# Altium schematic sheet Sheet1.SchDoc (part 1 of 3)
size 431 x 279 mm; SheetNumber: 1; SheetTotal: 1
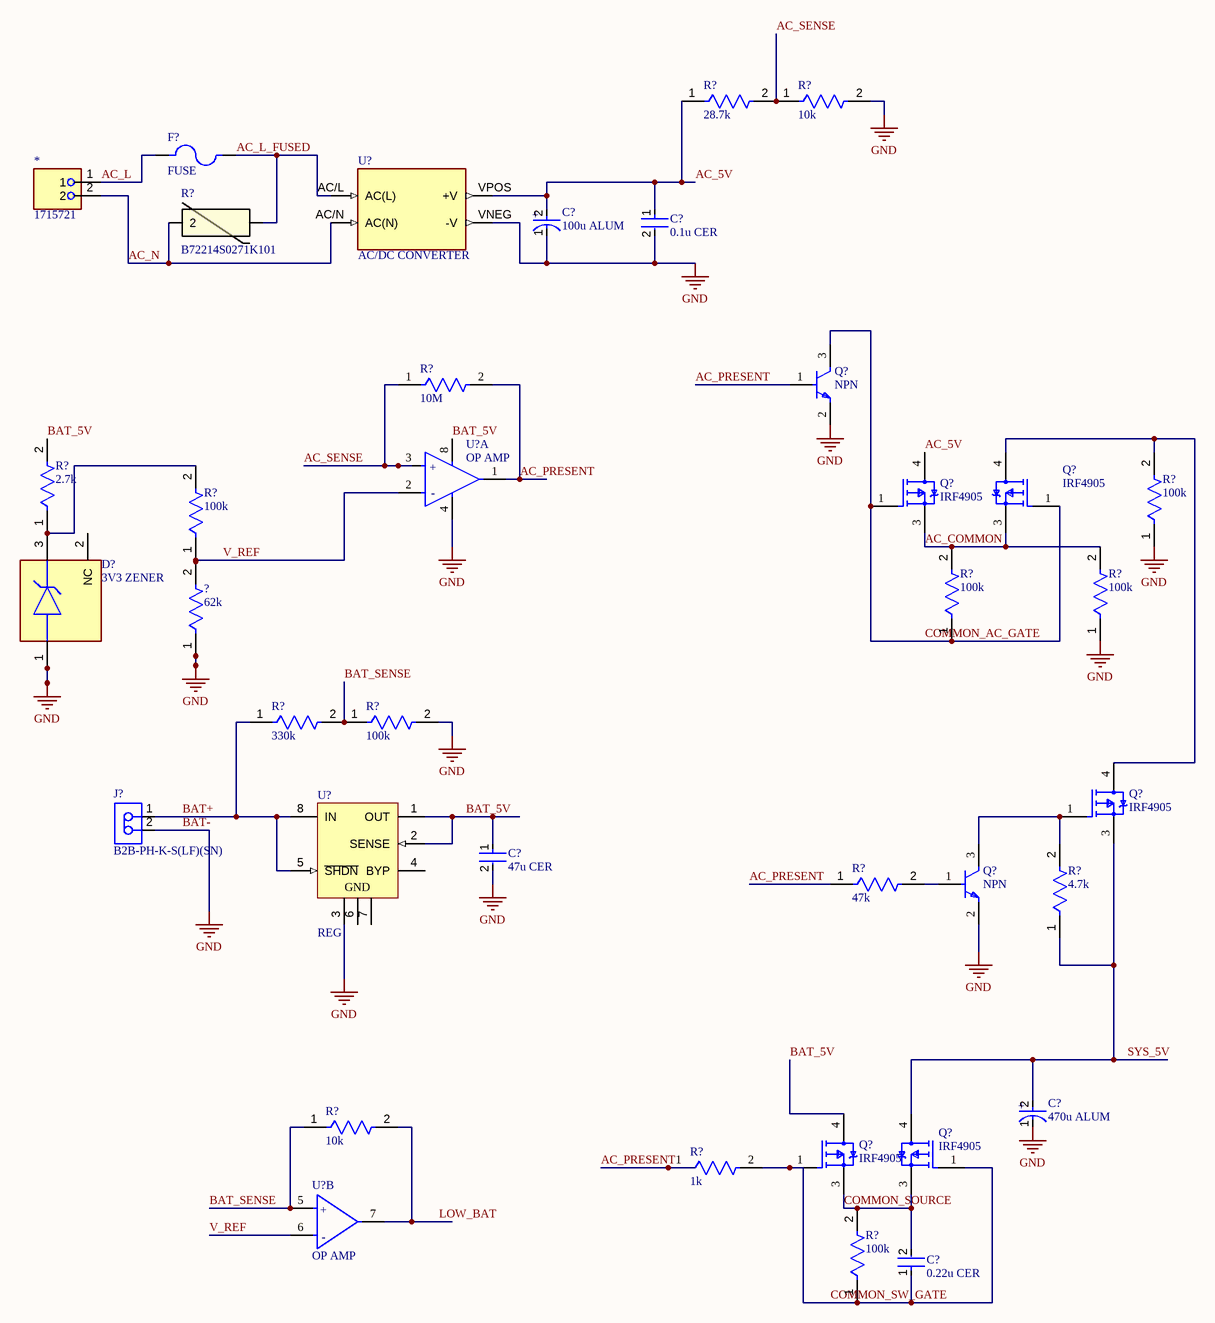
[diagram p0: Sheet1.SchDoc]

## Parts
(Parts that share a designator on the sheet are numbered #1, #2 ... from top to bottom, then left to right.)
*  1715721  [CONN_1715721_PXC]
?  62k  [0805_RES]
C?#1  100u ALUM  [FP-FTC-MFG]
C?#2  0.1u CER  [0805_CER_CAP]
C?#3  47u CER  [0805_CER_CAP]
C?#4  470u ALUM  [Radial_SMD_CAP]
C?#5  0.22u CER  [0805_CER_CAP]
D?  3V3 ZENER  [FP-SOT23-IPC_B_ZENER]
F?  FUSE  [FUSE_4628]
J?  B2B-PH-K-S(LF)(SN)  [JST-B2B-PH-K-S_V]
Q?#1  NPN  [FP-SOT323-IPC_B]
Q?#2  IRF4905  [FP-PG-TO263-3-MFG]
Q?#3  IRF4905  [FP-PG-TO263-3-MFG]
Q?#4  IRF4905  [FP-PG-TO263-3-MFG]
Q?#5  NPN  [FP-SOT323-IPC_B]
Q?#6  IRF4905  [FP-PG-TO263-3-MFG]
Q?#7  IRF4905  [FP-PG-TO263-3-MFG]
R?#1  28.7k  [0805_RES]
R?#2  10k  [0805_RES]
R?#3  B72214S0271K101  [VARS_B72214S0271K101_TDK]
R?#4  10M  [0805_RES]
R?#5  2.7k  [0805_RES]
R?#6  100k  [0805_RES]
R?#7  100k  [0805_RES]
R?#8  100k  [0805_RES]
R?#9  100k  [0805_RES]
R?#10  330k  [0805_RES]
R?#11  100k  [0805_RES]
R?#12  47k  [0805_RES]
R?#13  4.7k  [0805_RES]
R?#14  10k  [0805_RES]
R?#15  1k  [0805_RES]
R?#16  100k  [0805_RES]
U?#1  AC/DC CONVERTER
U?#2  OP AMP  [IC_TLV9062_8_SOIC]  (part A of 2)
U?#3  REG  [SO-8_S_LIT]
U?#4  OP AMP  [IC_TLV9062_8_SOIC]  (part B of 2)

## Nets
BAT-: ?.1 C?#1.1(C) C?#2.2 C?#3.2 C?#4.1(C) D?.1(A) J?.2 Q?#1.2(E) Q?#5.2(E) R?#2.2 R?#6.1 R?#9.1 R?#11.2 U?#1.VNEG(-V) U?#2.4(V-) U?#3.3(GND)  [also labelled GND]
AC_5V: C?#1.2(A) C?#2.1 Q?#2.4(D) R?#1.1 U?#1.VPOS(+V)
AC_COMMON: Q?#2.3(S) Q?#3.3(S) R?#8.2 R?#9.2
AC_L: *.1 F?.1
AC_L_FUSED: F?.2 R?#3.1 U?#1.AC/L(AC(L))
AC_N: *.2 R?#3.2 U?#1.AC/N(AC(N))
AC_PRESENT: Q?#1.1(B) R?#4.2 R?#12.1 R?#15.1 U?#2.1(OUT1)
AC_SENSE: R?#1.2 R?#2.1 R?#4.1 U?#2.3(IN1+)
BAT+: J?.1 R?#10.1 U?#3.5(~{SHDN}) U?#3.8(IN)
BAT_5V: C?#3.1 Q?#6.4(D) R?#5.2 U?#2.8(V+) U?#3.1(OUT) U?#3.2(SENSE)
BAT_SENSE: R?#10.2 R?#11.1 R?#14.1 U?#4.5(IN2+)
COMMON_AC_GATE: Q?#1.3(C) Q?#2.1(G) Q?#3.1(G) R?#8.1
COMMON_SOURCE: C?#5.2 Q?#6.3(S) Q?#7.3(S) R?#16.2
COMMON_SW_GATE: C?#5.1 Q?#6.1(G) Q?#7.1(G) R?#15.2 R?#16.1
LOW_BAT: R?#14.2 U?#4.7(OUT2)
SYS_5V: C?#4.2(A) Q?#4.3(S) Q?#7.4(D) R?#13.1
V_REF: ?.2 R?#7.1 U?#2.2(IN1-) U?#4.6(IN2-)
NetD?_3: D?.3(K) R?#5.1 R?#7.2
NetQ?#3_4: Q?#3.4(D) Q?#4.4(D) R?#6.2
NetQ?#4_1: Q?#4.1(G) Q?#5.3(C) R?#13.2
NetQ?#5_1: Q?#5.1(B) R?#12.2

Not connected (* = marked no-connect by the designer): D? 2(NC); U?#3 4(BYP) 6(GND) 7(GND)

## Notes on the sheet
- DWG. NO.
- REV.
- SHT.
- THIS DOCUMENT AND THE DATA DISCLOSED HEREIN OR HEREWITH IS THE PROPERTY OF ALTIUM LIMITED AND MAY BE FREELY DISTRIBUTED IN WHOLE. NO RIGHTS ARE RESERVED OR EXPRESS OR IMPLIED WARANTEE GIVEN.
- REVISION
- DESCRIPTION
- DATE
- APPROVED
- ENG:
- APPROVALS
- PROJECT
- DSN:
- CHK:
- REFERENCE DOCUMENTS
- PROJECT REVISION:
- TITLE
- DOCUMENT REVISION:
- DESIGN ITEM:
- BOM:
- FAB DWG:
- PCB DWG:
- ASSY DWG:
- SCALE:
- SIZE
- B
- CAGE CODE
- FILE NAME
- DWG NO.
- SHEET
- OF
- REV
- (in symbol EEEFK1A471P) +
- (in symbol EEEFT1C101AR) +
- (in symbol TLV9062IDR, part A) +; -
- (in symbol TLV9062IDR, part B) +; -